# Altium schematic sheet 401_GridPos4.SchDoc: Grid Position 4 / USB 3
size A2; Organization: Greenfield Tech Solutions; Address1: Molendreef 33; Address2: Ossendrecht; Address3: 4641CS; Address4: The Netherlands; SheetNumber: 5; SheetTotal: 9
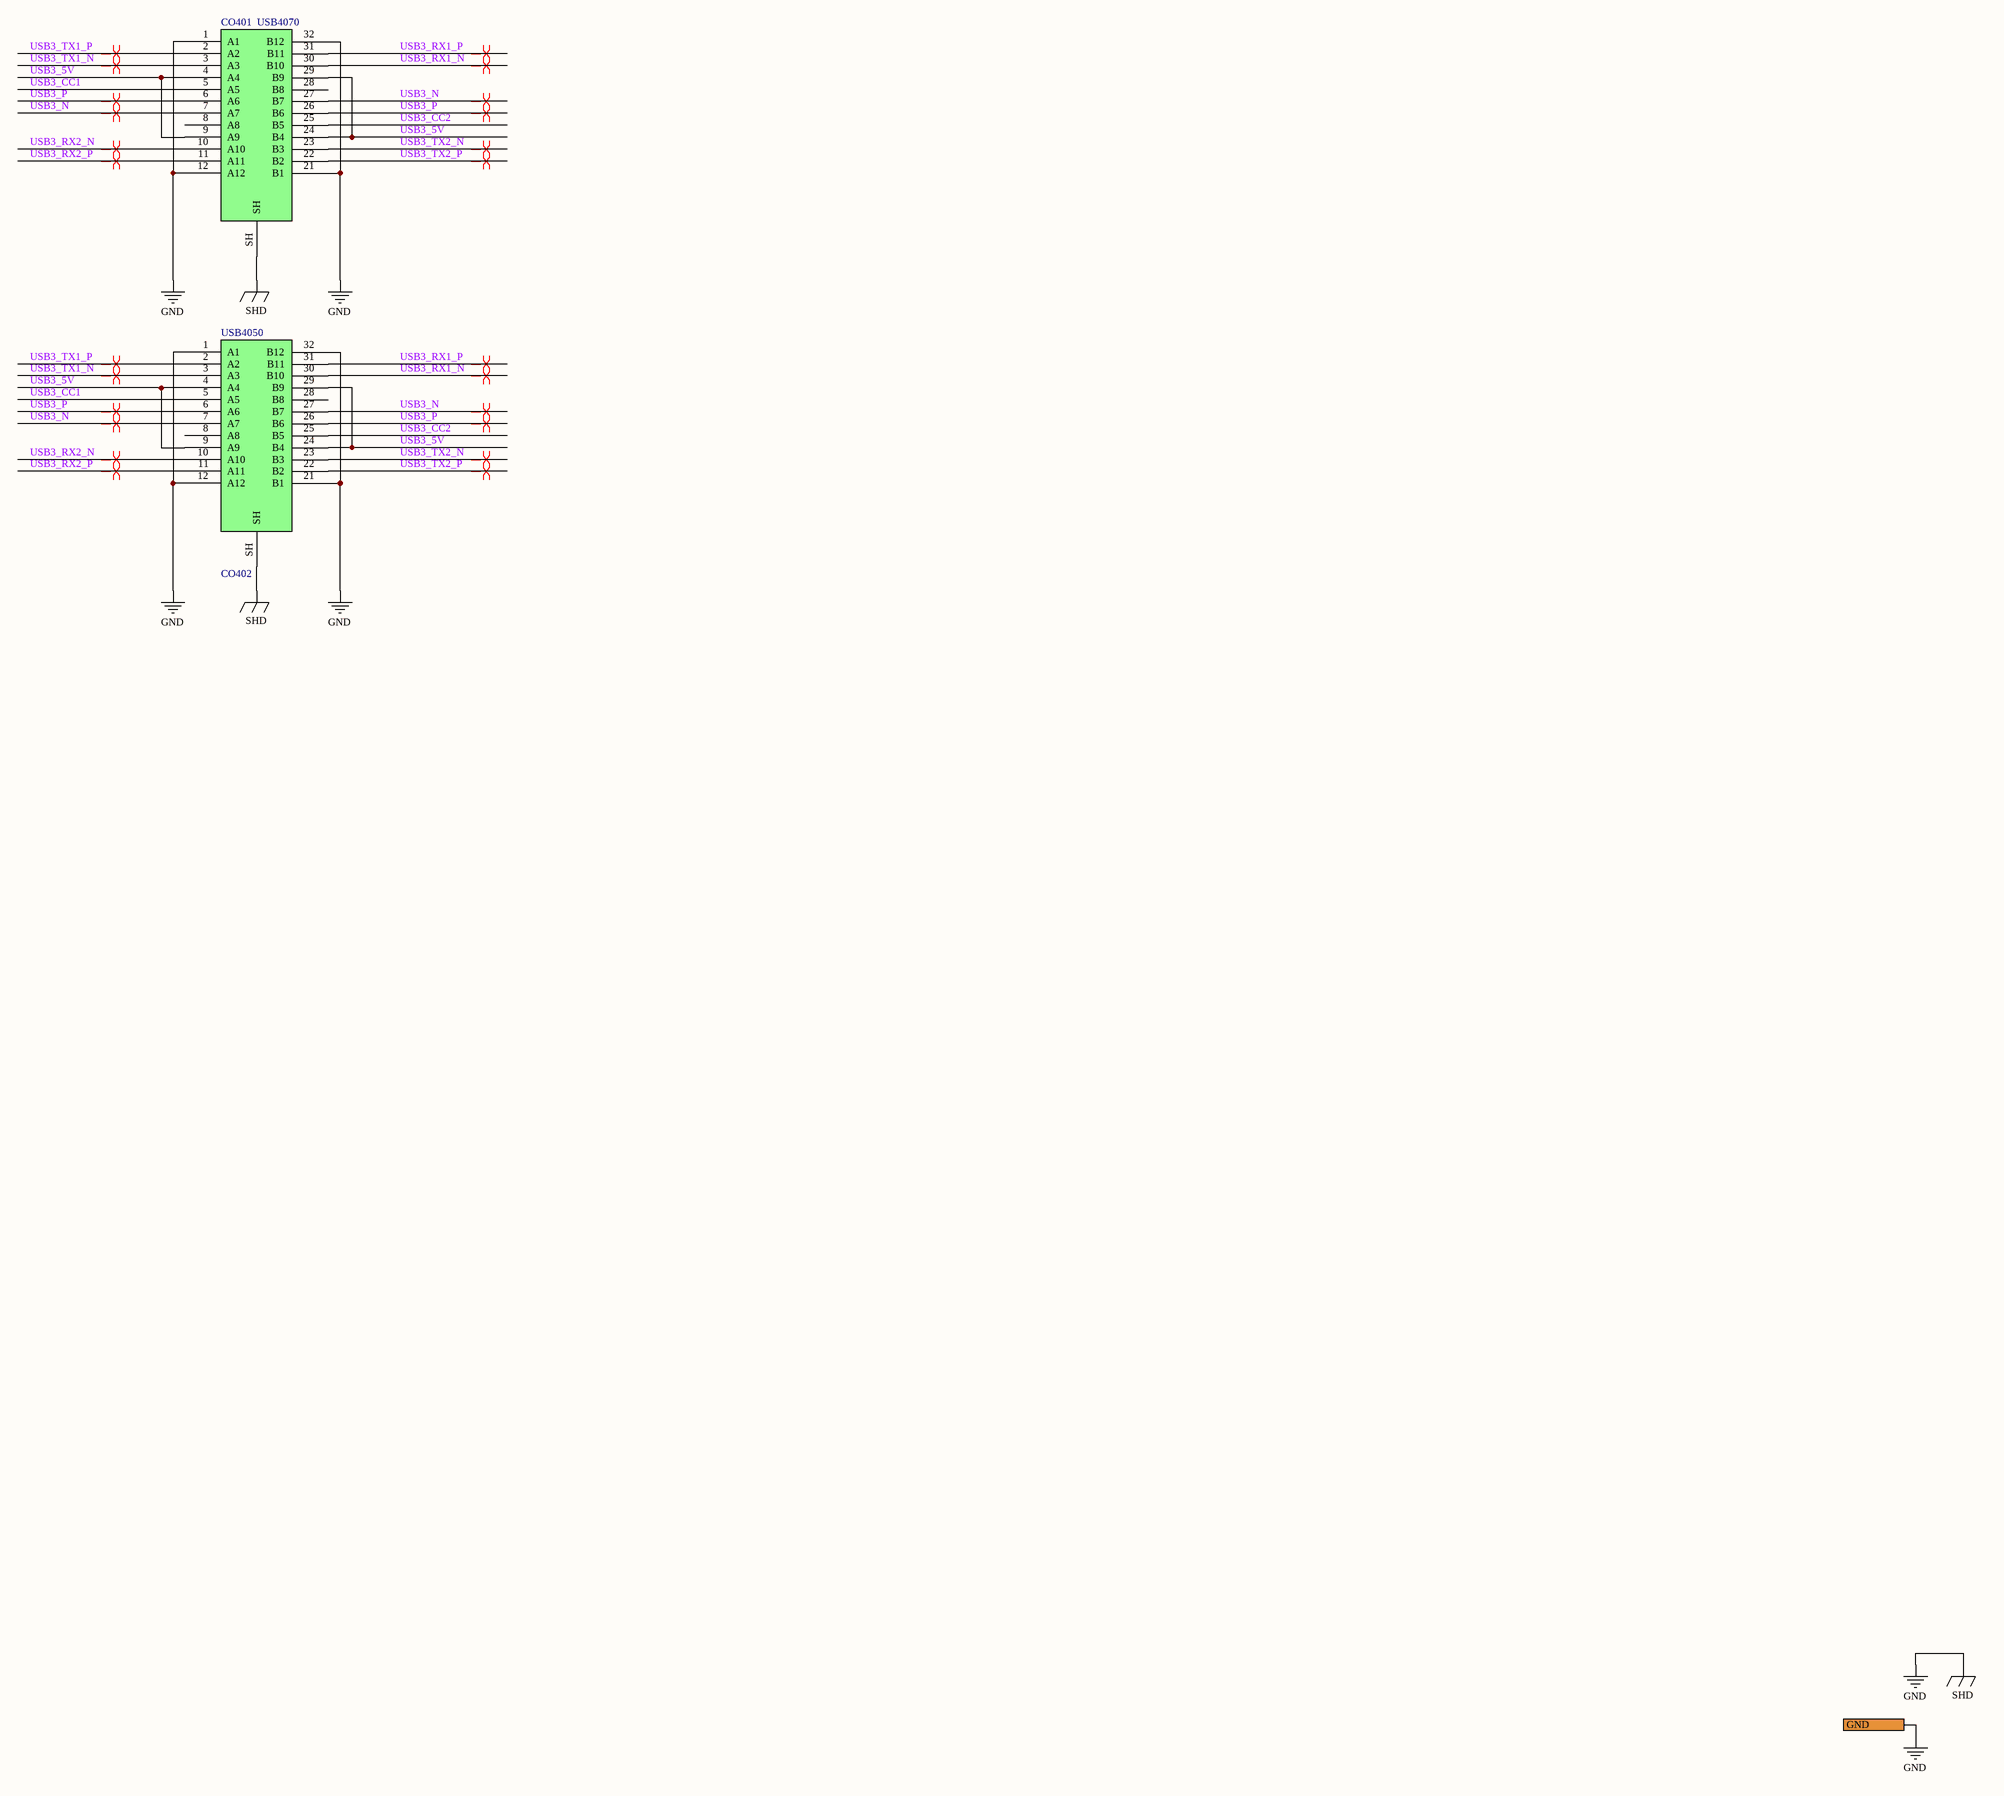
[diagram p0: 401_GridPos4.SchDoc]

## Parts
CO401  USB4070  [USB4070-30-C]
CO402  USB4050  [USB4050-30-A]

## Ports
GND

## Nets
GND: CO401.1(A1) CO401.12(A12) CO401.21(B1) CO401.32(B12) CO401.SH CO402.1(A1) CO402.12(A12) CO402.21(B1) CO402.32(B12) CO402.SH ; port GND  [also labelled SHD]
USB3_5V: CO401.4(A4) CO401.9(A9) CO401.24(B4) CO401.29(B9) CO402.4(A4) CO402.9(A9) CO402.24(B4) CO402.29(B9)
USB3_CC1: CO401.5(A5) CO402.5(A5)
USB3_CC2: CO401.25(B5) CO402.25(B5)
USB3_N: CO401.7(A7) CO401.27(B7) CO402.7(A7) CO402.27(B7)
USB3_P: CO401.6(A6) CO401.26(B6) CO402.6(A6) CO402.26(B6)
USB3_RX1_N: CO401.30(B10) CO402.30(B10)
USB3_RX1_P: CO401.31(B11) CO402.31(B11)
USB3_RX2_N: CO401.10(A10) CO402.10(A10)
USB3_RX2_P: CO401.11(A11) CO402.11(A11)
USB3_TX1_N: CO401.3(A3) CO402.3(A3)
USB3_TX1_P: CO401.2(A2) CO402.2(A2)
USB3_TX2_N: CO401.23(B3) CO402.23(B3)
USB3_TX2_P: CO401.22(B2) CO402.22(B2)

Not connected (* = marked no-connect by the designer): CO401 8(A8) 28(B8); CO402 8(A8) 28(B8)

## Layout directives
differential pair; differential pair class USB3: USB3_N, USB3_P, USB3_RX1_N, USB3_RX1_P, USB3_RX2_N, USB3_RX2_P, USB3_TX1_N, USB3_TX1_P, USB3_TX2_N, USB3_TX2_P

## Notes on the sheet
- Title
- Size:
- Date:
- File:
- A2
- Number:
- Time:
- Revision:
- Sheet
- of

## Library data of the parts
CO401 = CO0021: USB4070-30-C; Part Number: CO0021; ID: 16; RefVal: USB4070; ManfactPart: USB4070-30-C
CO402 = CO0039: USB C connector Receptacle Horizontal; Part Number: CO0039; ID: 39; RefVal: USB4050; ManfactPart: USB4050-30-A